# Altium schematic sheet 12V_9V_Power_Stage.SchDoc (part 4 of 4)
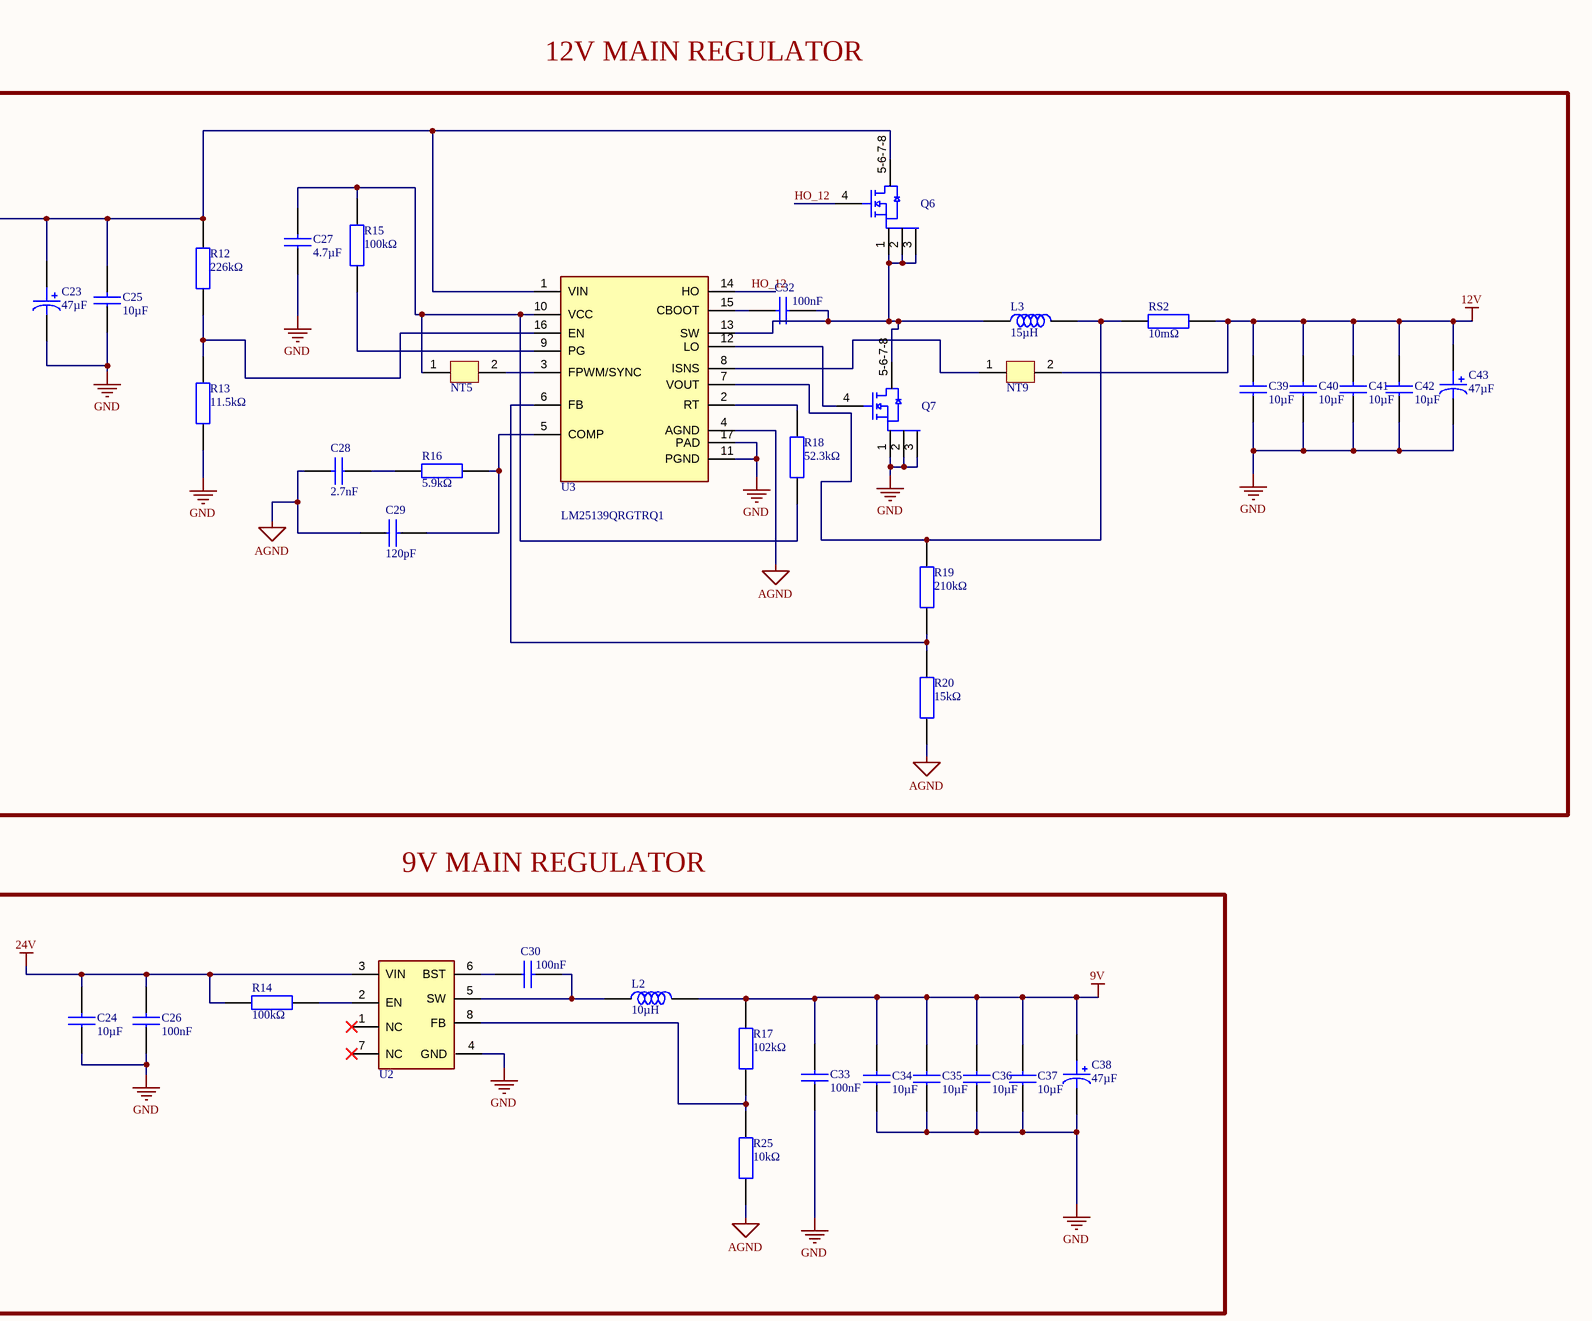
[diagram p4: 12V_9V_Power_Stage.SchDoc, right]

## Library data of the parts (continued)
U2 = TPS563300DRLR: 3.8-V to 28-V Input, 3-A synchronous buck converter in SOT-583 package 8-SOT-5X3 -40 to 150; Manufacturer: Texas Instruments; Manufacturer Lifecycle Status: ACTIVE; Supplier: Mouser; Supplier Part Number: 595-TPS563300DRLR; Manufacturer Part Number: TPS563300DRLR; RoHS: Compliant; Category: Voltage Regulators - Switching; Stock: 32724; Pricing: 1=1,32, 10=0,956, 50=0,864, 100=0,762, 1000=0,605, 10000=0,531 (USD); Height: 0m; Length: 2.1mm; Lifecycle Status: Production; Pins: 8; Thickness: 550µm; Topology: Buck; Width: 1.2mm; ComponentLink1URL: https://sigma.octopart.com:443/184160452/technical_drawing/Texas-Instruments-TPS563300DRLR.pdf?src-supplier=Texas+Instruments; ComponentLink1Description: https://sigma.octopart.com:443/184160452/technical_drawing/Texas-Instruments-TPS563300DRLR.pdf?src-supplier=Texas+Instruments; ComponentLink2URL: https://octopart.com:443/opatz8j6/c1?t=xatpEYDGIma3GWOGr9dSa4ETkpKnF2SQQa13bM9aBU7KxWKWjVvMG3OPAuux2PU110RkBH42izBS6LQikCKLapn2aXxzoaBnKyQv6nxenhgHckViipDy1bQp576I8K_6VNlc5vIfTlftyYntTgTTchaaEZUGX-QlB6H4FcZbf9QiACksJe2cvrVzl7ha9aT0dFxNxtO1rifgiUUvS9aKQPq8xHoc_jRZa0IMvCz_1WpyurF6xnm4nw4x1HnPVrE7nKBo3o6VYz8s45vJQula6-TlgbN471KnlcUrcyjw7J9yvMadwJHAulvEz1WOv1H4BbQVsLOSbcIeQMVCaHMcaU52k2MGaSgAor6JMwICFe1qviFLaeeRGWmBODRvWzrX-l5DBmed0Tw&src-supplier=Texas+Instruments; ComponentLink2Description: https://octopart.com:443/opatz8j6/c1?t=xatpEYDGIma3GWOGr9dSa4ETkpKnF2SQQa13bM9aBU7KxWKWjVvMG3OPAuux2PU110RkBH42izBS6LQikCKLapn2aXxzoaBnKyQv6nxenhgHckViipDy1bQp576I8K_6VNlc5vIfTlftyYntTgTTchaaEZUGX-QlB6H4FcZbf9QiACksJe2cvrVzl7ha9aT0dFxNxtO1rifgiUUvS9aKQPq8xHoc_jRZa0IMvCz_1WpyurF6xnm4nw4x1HnPVrE7nKBo3o6VYz8s45vJQula6-TlgbN471KnlcUrcyjw7J9yvMadwJHAulvEz1WOv1H4BbQVsLOSbcIeQMVCaHMcaU52k2MGaSgAor6JMwICFe1qviFLaeeRGWmBODRvWzrX-l5DBmed0Tw&src-supplier=Texas+Instruments; ComponentLink3URL: https://sigma.octopart.com:443/182665545/technical_drawing/Texas-Instruments-TPS563300DRLR.pdf?src-supplier=Texas+Instruments; ComponentLink3Description: https://sigma.octopart.com:443/182665545/technical_drawing/Texas-Instruments-TPS563300DRLR.pdf?src-supplier=Texas+Instruments; ComponentLink4URL: https://sigma.octopart.com:443/158891806/technical_drawing/Texas-Instruments-TPS563300DRLR.pdf?src-supplier=Texas+Instruments; ComponentLink4Description: https://sigma.octopart.com:443/158891806/technical_drawing/Texas-Instruments-TPS563300DRLR.pdf?src-supplier=Texas+Instruments; ComponentLink5URL: https://datasheet.octopart.com:443/TPS563300DRLR-Texas-Instruments-datasheet-179559971.pdf?src-supplier=LCSC; ComponentLink5Description: https://datasheet.octopart.com:443/TPS563300DRLR-Texas-Instruments-datasheet-179559971.pdf?src-supplier=LCSC; ComponentLink6URL: http://sigma.octopart.com:80/reach_statement/Texas-Instruments-company-64.pdf?src-supplier=Compliance+Statements; ComponentLink6Description: http://sigma.octopart.com:80/reach_statement/Texas-Instruments-company-64.pdf?src-supplier=Compliance+Statements; ComponentLink7URL: http://sigma.octopart.com:80/conflict_mineral_statement/Texas-Instruments-company-63.pdf?src-supplier=Compliance+Statements; ComponentLink7Description: http://sigma.octopart.com:80/conflict_mineral_statement/Texas-Instruments-company-63.pdf?src-supplier=Compliance+Statements
U3 = LM25139QRGTRQ1: Automotive 42V input low-Iq buck controller with advanced spread spectrum for low EMI 16-VQFN -40 to 150; Manufacturer: Texas Instruments; Manufacturer Lifecycle Status: ACTIVE; Supplier: Arrow Electronics; Supplier Part Number: LM25139QRGTRQ1; Manufacturer Part Number: LM25139QRGTRQ1; RoHS: Compliant; Category: Integrated Circuits (ICs); Pricing: 3000=1,4038, 6000=1,3973, 9000=1,3906, 12000=1,384, 15000=1,3772, 21000=1,3704, 24000=1,3635, 30000=1,3565, 75000=1,3494 (USD); Case/Package: VQFN; Height: 1mm; Length: 3mm; Lifecycle Status: Production; Pins: 16; Thickness: 900µm; Width: 3mm; ComponentLink1URL: https://octopart.com:443/opatz8j6/c1?t=xWWGwO3ec4Sx5CX0X2qnIhfOHeHqh3WO1mWCu4fV70Hd-1hWOrNd3lhOLVAWMYEEdzkDMYq8UgUcPu2a5nJWOdgA0b1awjV5RgR9D21gaMlGiLRjb7yDuVOicm1d_02R7igS8Xl7-riSRfD_iig_z43OjN5LLsjZDt-zpIDOeZS1dmRgmlIMnUHEnLRcU50Rs-JpA3b7vouLRhIT49FH8fzbO6qOR_6mRAVC4kh14i2ZohtaykkOFzOvEuXGiEP1bYPJMrSXFUnpstjeZJ5v1PNY2ZRTlMohWo1i0R4TEEEijwc0FwBrv5FRwCkRRvUZM3VTnVJr8q7ERahnvQ1r2dQr48eXvtum-5d3g9rmVpLBhcUjM08_c0KTsN9BfI_8WmgwxHDs6sfT&src-supplier=Texas+Instruments; ComponentLink1Description: https://octopart.com:443/opatz8j6/c1?t=xWWGwO3ec4Sx5CX0X2qnIhfOHeHqh3WO1mWCu4fV70Hd-1hWOrNd3lhOLVAWMYEEdzkDMYq8UgUcPu2a5nJWOdgA0b1awjV5RgR9D21gaMlGiLRjb7yDuVOicm1d_02R7igS8Xl7-riSRfD_iig_z43OjN5LLsjZDt-zpIDOeZS1dmRgmlIMnUHEnLRcU50Rs-JpA3b7vouLRhIT49FH8fzbO6qOR_6mRAVC4kh14i2ZohtaykkOFzOvEuXGiEP1bYPJMrSXFUnpstjeZJ5v1PNY2ZRTlMohWo1i0R4TEEEijwc0FwBrv5FRwCkRRvUZM3VTnVJr8q7ERahnvQ1r2dQr48eXvtum-5d3g9rmVpLBhcUjM08_c0KTsN9BfI_8WmgwxHDs6sfT&src-supplier=Texas+Instruments; ComponentLink2URL: http://sigma.octopart.com:80/reach_statement/Texas-Instruments-company-64.pdf?src-supplier=Compliance+Statements; ComponentLink2Description: http://sigma.octopart.com:80/reach_statement/Texas-Instruments-company-64.pdf?src-supplier=Compliance+Statements; ComponentLink3URL: http://sigma.octopart.com:80/conflict_mineral_statement/Texas-Instruments-company-63.pdf?src-supplier=Compliance+Statements; ComponentLink3Description: http://sigma.octopart.com:80/conflict_mineral_statement/Texas-Instruments-company-63.pdf?src-supplier=Compliance+Statements